# EAGLE schematic backpack_board (EAGLE 9.3.2)

## Sheet 1 of 5: Power
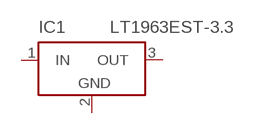
[diagram p0: schematic, sheet 1]

### Parts
IC1  LT1963EST-3.3  [SOT223]
Unconnected: IC1.1(IN) IC1.3(OUT)

## Sheet 2 of 5: 8040 Chip
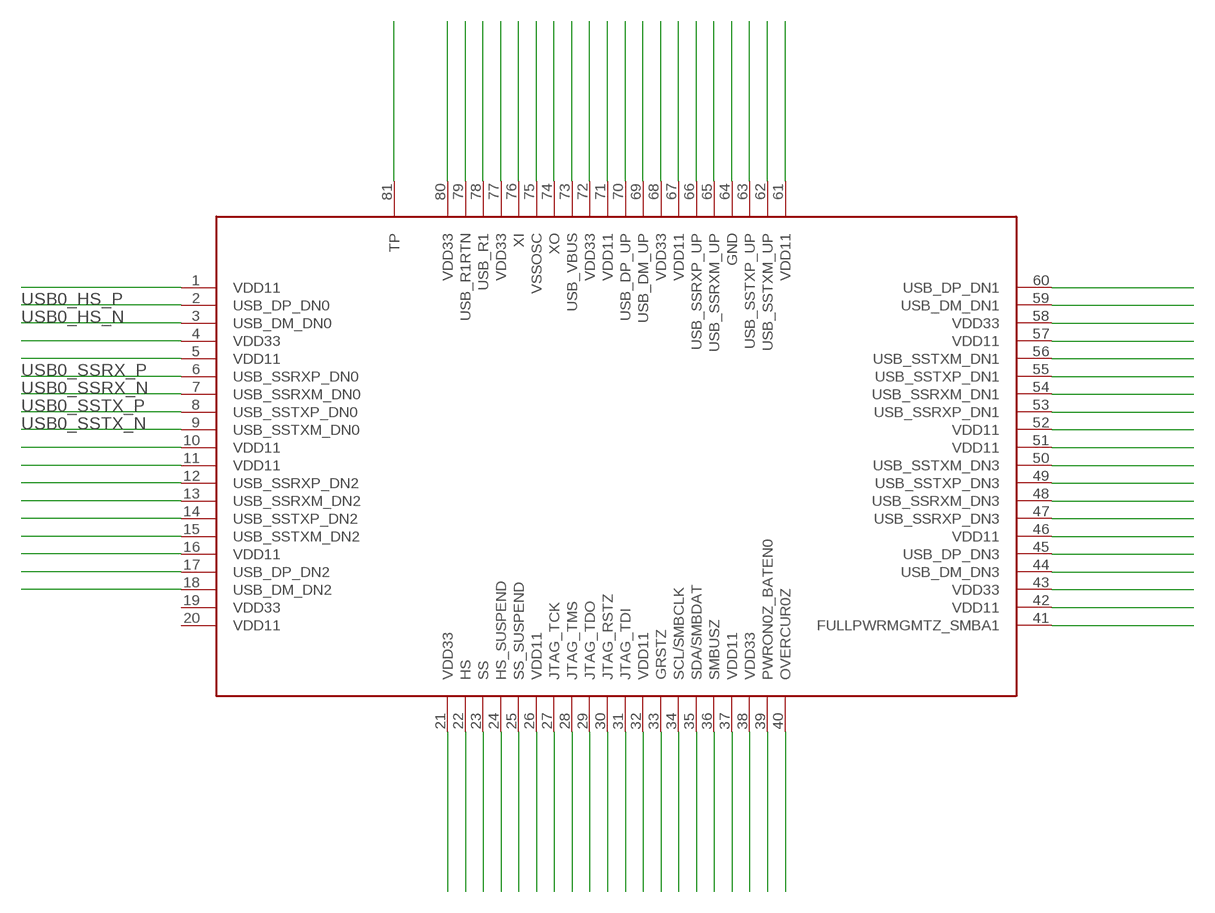
[diagram p1: schematic, sheet 2]

### Parts
U$2  TUSB8040PFP  [S-PQFP-G80]

### Nets
N$28: U$2.12(USB_SSRXP_DN2)
N$29: U$2.13(USB_SSRXM_DN2)
N$30: U$2.14(USB_SSTXP_DN2)
N$31: U$2.15(USB_SSTXM_DN2)
N$32: U$2.16(VDD11)
N$33: U$2.17(USB_DP_DN2)
N$34: U$2.18(USB_DM_DN2)
N$35: U$2.60(USB_DP_DN1)
N$36: U$2.59(USB_DM_DN1)
N$37: U$2.58(VDD33)
N$38: U$2.57(VDD11)
N$39: U$2.56(USB_SSTXM_DN1)
N$40: U$2.55(USB_SSTXP_DN1)
N$41: U$2.54(USB_SSRXM_DN1)
N$42: U$2.53(USB_SSRXP_DN1)
N$43: U$2.52(VDD11)
N$44: U$2.51(VDD11)
N$45: U$2.50(USB_SSTXM_DN3)
N$46: U$2.49(USB_SSTXP_DN3)
N$47: U$2.48(USB_SSRXM_DN3)
N$48: U$2.47(USB_SSRXP_DN3)
N$49: U$2.46(VDD11)
N$50: U$2.45(USB_DP_DN3)
N$51: U$2.44(USB_DM_DN3)
N$52: U$2.43(VDD33)
N$53: U$2.42(VDD11)
N$54: U$2.41(FULLPWRMGMTZ_SMBA1)
N$55: U$2.70(USB_DP_UP)
N$56: U$2.25(SS_SUSPEND)
N$57: U$2.80(VDD33)
N$58: U$2.79(USB_R1RTN)
N$59: U$2.78(USB_R1)
N$60: U$2.77(VDD33)
N$61: U$2.76(XI)
N$62: U$2.75(VSSOSC)
N$63: U$2.74(XO)
N$64: U$2.73(USB_VBUS)
N$65: U$2.72(VDD33)
N$66: U$2.71(VDD11)
N$67: U$2.69(USB_DM_UP)
N$68: U$2.68(VDD33)
N$69: U$2.67(VDD11)
N$70: U$2.66(USB_SSRXP_UP)
N$71: U$2.65(USB_SSRXM_UP)
N$72: U$2.64(GND)
N$73: U$2.63(USB_SSTXP_UP)
N$74: U$2.62(USB_SSTXM_UP)
N$75: U$2.61(VDD11)
N$76: U$2.1(VDD11)
N$77: U$2.4(VDD33)
N$78: U$2.5(VDD11)
N$79: U$2.10(VDD11)
N$80: U$2.11(VDD11)
N$81: U$2.21(VDD33)
N$82: U$2.22(HS)
N$83: U$2.23(SS)
N$84: U$2.24(HS_SUSPEND)
N$85: U$2.26(VDD11)
N$86: U$2.27(JTAG_TCK)
N$87: U$2.28(JTAG_TMS)
N$88: U$2.29(JTAG_TDO)
N$89: U$2.30(JTAG_RSTZ)
N$90: U$2.31(JTAG_TDI)
N$91: U$2.32(VDD11)
N$92: U$2.33(GRSTZ)
N$93: U$2.34(SCL/SMBCLK)
N$94: U$2.35(SDA/SMBDAT)
N$95: U$2.36(SMBUSZ)
N$96: U$2.37(VDD11)
N$97: U$2.38(VDD33)
N$98: U$2.39(PWRON0Z_BATEN0)
N$99: U$2.40(OVERCUR0Z)
N$100: U$2.81(TP)
USB0_HS_N: U$2.3(USB_DM_DN0) ; also sheet 3
USB0_HS_P: U$2.2(USB_DP_DN0) ; also sheet 3
USB0_SSRX_N: U$2.7(USB_SSRXM_DN0) ; also sheet 3
USB0_SSRX_P: U$2.6(USB_SSRXP_DN0) ; also sheet 3
USB0_SSTX_N: U$2.9(USB_SSTXM_DN0) ; also sheet 3
USB0_SSTX_P: U$2.8(USB_SSTXP_DN0) ; also sheet 3
Unconnected: U$2.19(VDD33) U$2.20(VDD11)

## Sheet 3 of 5: 9261 Chip
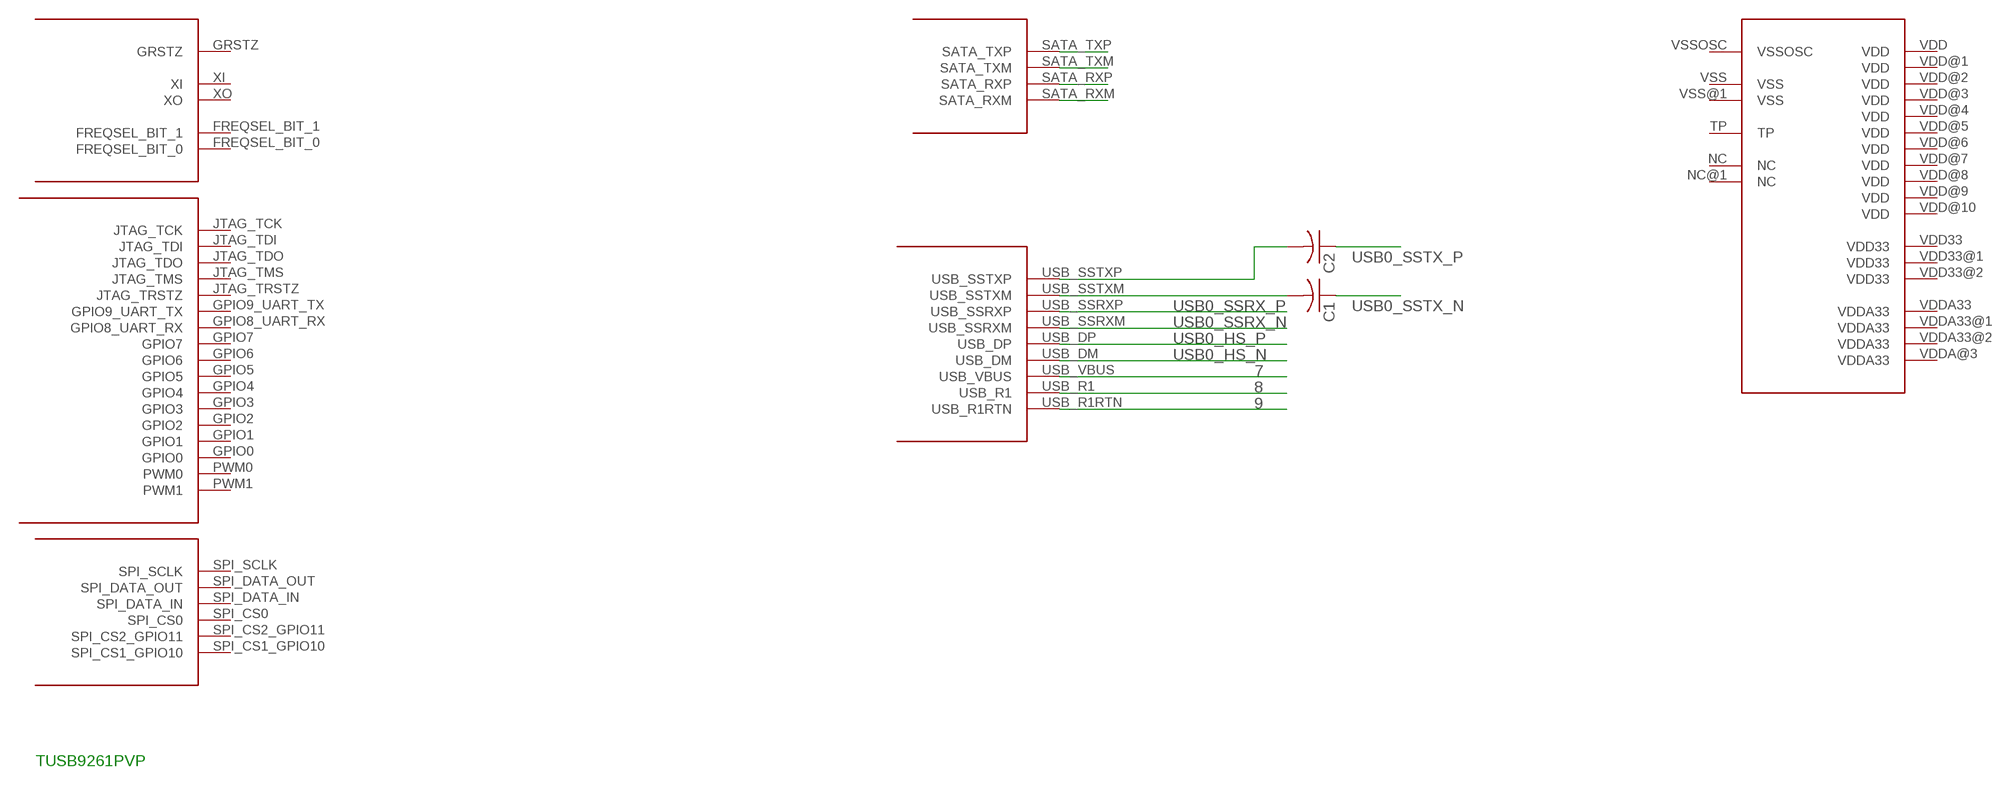
[diagram p2: schematic, sheet 3]

### Parts
C1  C-USC0402  [C0402]
C2  C-USC0402  [C0402]
U$1  TUSB9261PVP  [S-PQFP-G64]

### Nets
7: U$1.USB_VBUS
8: U$1.USB_R1
9: U$1.USB_R1RTN
N$101: U$1.SATA_TXP
N$102: U$1.SATA_TXM
N$103: U$1.SATA_RXP
N$104: U$1.SATA_RXM
SATA_SSTXP_N: C1.2 U$1.USB_SSTXM
SATA_SSTXP_P: C2.2 U$1.USB_SSTXP
USB0_HS_N: U$1.USB_DM ; also sheet 2
USB0_HS_P: U$1.USB_DP ; also sheet 2
USB0_SSRX_N: U$1.USB_SSRXM ; also sheet 2
USB0_SSRX_P: U$1.USB_SSRXP ; also sheet 2
USB0_SSTX_N: C1.1 ; also sheet 2
USB0_SSTX_P: C2.1 ; also sheet 2
Unconnected: U$1.FREQSEL_BIT_0 U$1.FREQSEL_BIT_1 U$1.GPIO0 U$1.GPIO1 U$1.GPIO2 U$1.GPIO3 U$1.GPIO4 U$1.GPIO5 U$1.GPIO6 U$1.GPIO7 U$1.GPIO8_UART_RX U$1.GPIO9_UART_TX U$1.GRSTZ U$1.JTAG_TCK U$1.JTAG_TDI U$1.JTAG_TDO U$1.JTAG_TMS U$1.JTAG_TRSTZ U$1.PWM0 U$1.PWM1 U$1.SPI_CS0 U$1.SPI_CS1_GPIO10 U$1.SPI_CS2_GPIO11 U$1.SPI_DATA_IN U$1.SPI_DATA_OUT U$1.SPI_SCLK U$1.XI U$1.XO

### Notes on the sheet
- TUSB9261PVP

## Sheet 4 of 5: USB Ports
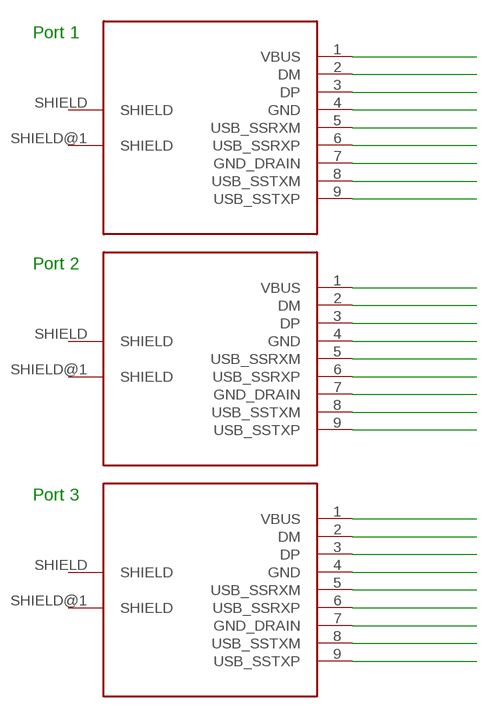
[diagram p3: schematic, sheet 4]

### Parts
U$3  USB_SS_CONN_TYPE_A  [R_A_DIP]
U$4  USB_SS_CONN_TYPE_A  [R_A_DIP]
U$5  USB_SS_CONN_TYPE_A  [R_A_DIP]

### Nets
N$1: U$3.1(VBUS)
N$2: U$3.2(DM)
N$3: U$3.3(DP)
N$4: U$3.4(GND)
N$5: U$3.5(USB_SSRXM)
N$6: U$3.6(USB_SSRXP)
N$7: U$3.7(GND_DRAIN)
N$8: U$3.8(USB_SSTXM)
N$9: U$3.9(USB_SSTXP)
N$10: U$4.1(VBUS)
N$11: U$4.2(DM)
N$12: U$4.3(DP)
N$13: U$4.4(GND)
N$14: U$4.5(USB_SSRXM)
N$15: U$4.6(USB_SSRXP)
N$16: U$4.7(GND_DRAIN)
N$17: U$4.8(USB_SSTXM)
N$18: U$4.9(USB_SSTXP)
N$19: U$5.1(VBUS)
N$20: U$5.2(DM)
N$21: U$5.3(DP)
N$22: U$5.4(GND)
N$23: U$5.5(USB_SSRXM)
N$24: U$5.6(USB_SSRXP)
N$25: U$5.7(GND_DRAIN)
N$26: U$5.8(USB_SSTXM)
N$27: U$5.9(USB_SSTXP)
Unconnected: U$3.SHIELD U$3.SHIELD@1(SHIELD) U$4.SHIELD U$4.SHIELD@1(SHIELD) U$5.SHIELD U$5.SHIELD@1(SHIELD)

### Notes on the sheet
- Port 1
- Port 2
- Port 3

## Sheet 5 of 5: SATA Port
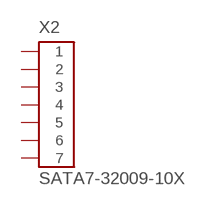
[diagram p4: schematic, sheet 5]

### Parts
X2  SATA7-32009-10X  [CCATA_32009_10X]
Unconnected: X2.1 X2.2 X2.3 X2.4 X2.5 X2.6 X2.7

## Power pins joined to a net without a drawn wire
GND: IC1.2(GND) IC1.4(GND)
NC: U$1.NC U$1.NC@1(NC)
TP: U$1.TP
VDD: U$1.VDD U$1.VDD@1(VDD) U$1.VDD@2(VDD) U$1.VDD@3(VDD) U$1.VDD@4(VDD) U$1.VDD@5(VDD) U$1.VDD@6(VDD) U$1.VDD@7(VDD) U$1.VDD@8(VDD) U$1.VDD@9(VDD) U$1.VDD@10(VDD)
VDD33: U$1.VDD33 U$1.VDD33@1(VDD33) U$1.VDD33@2(VDD33)
VDDA33: U$1.VDDA33 U$1.VDDA33@1(VDDA33) U$1.VDDA33@2(VDDA33) U$1.VDDA@3(VDDA33)
VSS: U$1.VSS U$1.VSS@1(VSS)
VSSOSC: U$1.VSSOSC

## Library data of the parts
C1 C2 = rcl:C-US: CAPACITOR, American symbol
IC1 = linear-technology:LT1963EST: 1.5A, Low Noise, Fast Transient Response LDO Regulator Source: http://www.linear.com/pc/downloadDocument.do?navId=H0,C3,P2222,D3148; MPN: LT1963EST-3.3; OC_FARNELL: 1501032; OC_NEWARK: 57M7546
U$1 = tusb9261pvp:TUSB9261PVP: The TUSB9261PVP is a SATA to USB 3 bridge. Author: Travis Estep Date: 4/21/14
U$2 = tusb8040a1:TUSB8040PFP: TUSB8040 is a 4-port SuperSPeed USB 3.0 hub.
U$3-U$5 = usb3_type_a:USB_SS_CONN_TYPE_A: USB 3 SuperSpeed Type A connector, through hole design.
X2 = con-cypressindustries:SATA7-: Serial ATA 7 Pol. Source: www.cypressindustries.com; OC_FARNELL: unknown; OC_NEWARK: unknown